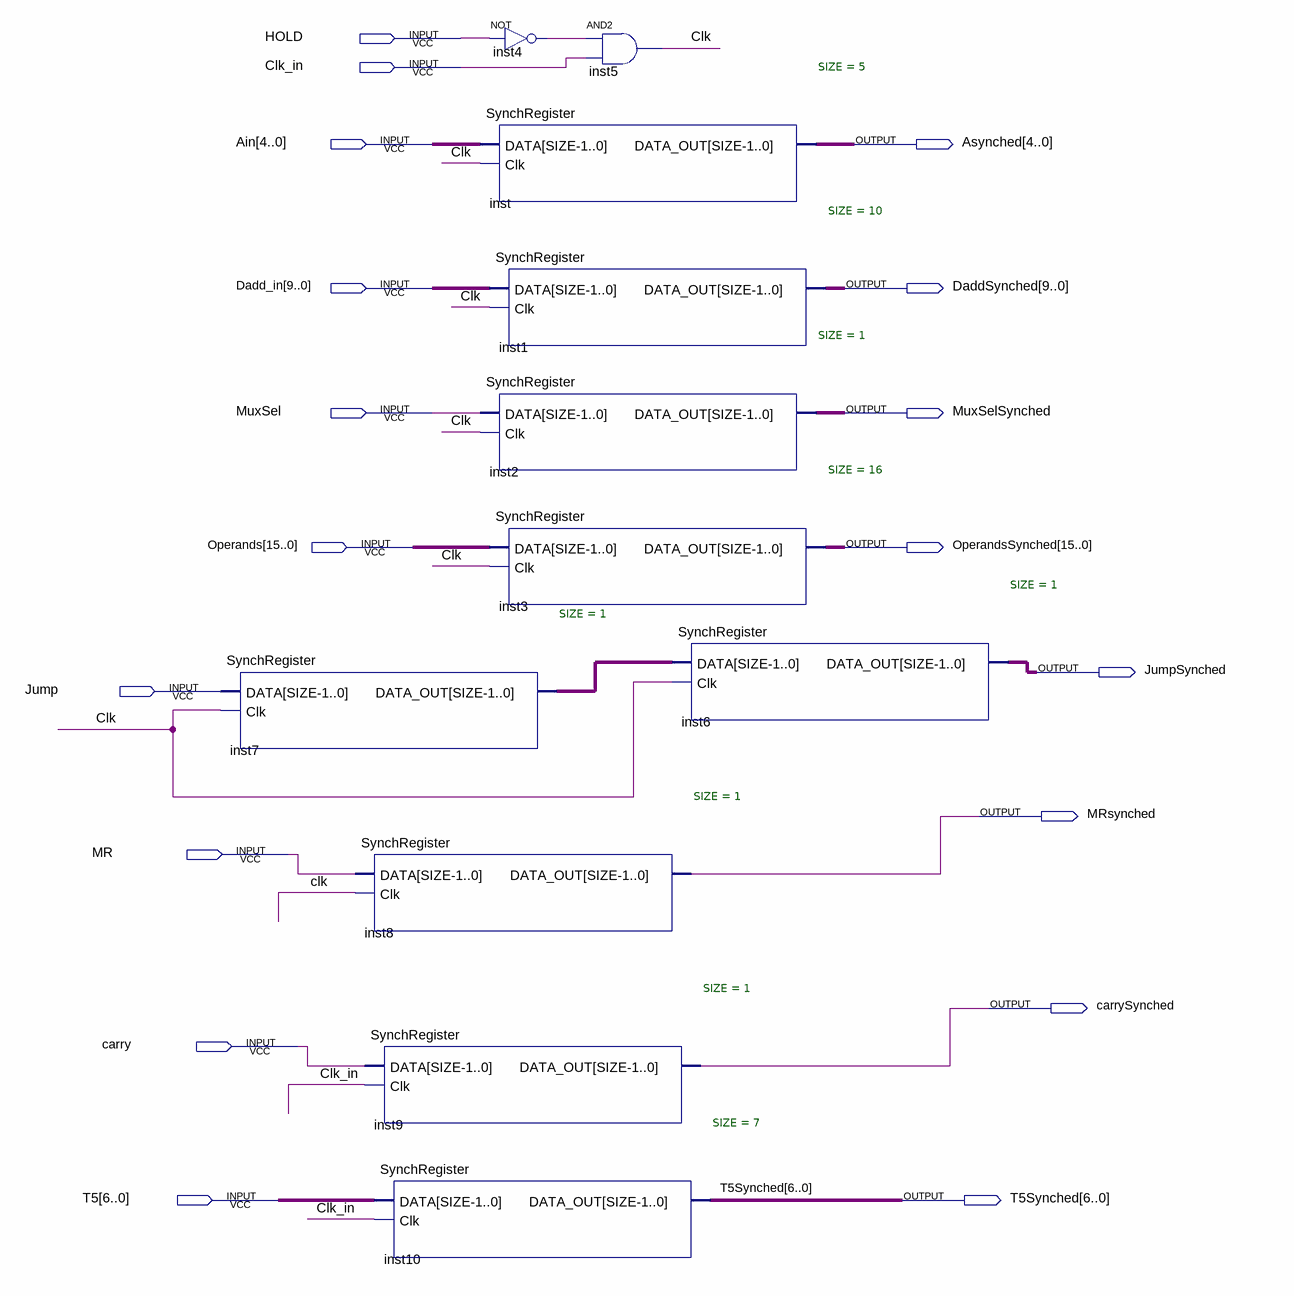
[diagram p0: schematic sheet]
// Quartus schematic SynchUnit.bdf as structural Verilog: 11 symbols, 18 pins
module SynchUnit (
  input  HOLD,
  input  Clk_in,
  input  [4:0] Ain,
  input  [9:0] Dadd_in,
  input  MuxSel,
  input  [15:0] Operands,
  input  Jump,
  input  MR,
  input  carry,
  input  [6:0] T5,
  output [4:0] Asynched,
  output [9:0] DaddSynched,
  output MuxSelSynched,
  output [15:0] OperandsSynched,
  output JumpSynched,
  output MRsynched,
  output carrySynched,
  output [6:0] T5Synched
);

  wire Clk, inst4_out, inst7_data_out;

  SynchRegister #(.SIZE(1)) inst7 (.DATA(Jump), .Clk(Clk), .DATA_OUT(inst7_data_out));
  SynchRegister #(.SIZE(1)) inst8 (.DATA(MR), .Clk(Clk), .DATA_OUT(MRsynched));
  SynchRegister #(.SIZE(1)) inst9 (.DATA(carry), .Clk(Clk_in), .DATA_OUT(carrySynched));
  SynchRegister #(.SIZE(7)) inst10 (.DATA(T5), .Clk(Clk_in), .DATA_OUT(T5Synched));
  not inst4 (inst4_out, HOLD);
  SynchRegister #(.SIZE(5)) inst (.DATA(Ain), .Clk(Clk), .DATA_OUT(Asynched));
  SynchRegister #(.SIZE(10)) inst1 (.DATA(Dadd_in), .Clk(Clk), .DATA_OUT(DaddSynched));
  SynchRegister #(.SIZE(1)) inst2 (.DATA(MuxSel), .Clk(Clk), .DATA_OUT(MuxSelSynched));
  SynchRegister #(.SIZE(16)) inst3 (.DATA(Operands), .Clk(Clk), .DATA_OUT(OperandsSynched));
  and inst5 (Clk, inst4_out, Clk_in);
  SynchRegister #(.SIZE(1)) inst6 (.DATA(inst7_data_out), .Clk(Clk), .DATA_OUT(JumpSynched));
endmodule
